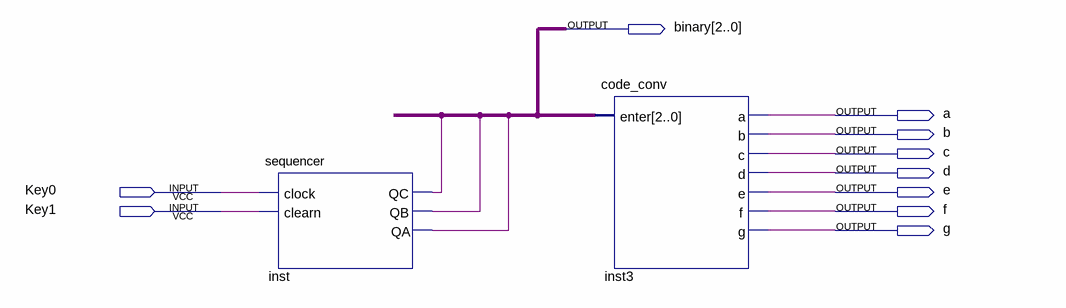
[diagram p0: schematic sheet]
// Quartus schematic procedure_3.bdf as structural Verilog: 2 symbols, 10 pins
module procedure_3 (
  input  Key0,
  input  Key1,
  output [2:0] binary,
  output a,
  output b,
  output c,
  output d,
  output e,
  output f,
  output g
);

  wire inst_qa, inst_qb, inst_qc;

  sequencer inst (.clock(Key0), .clearn(Key1), .QC(inst_qc), .QB(inst_qb), .QA(inst_qa));
  code_conv inst3 (.enter(binary), .a(a), .b(b), .c(c), .d(d), .e(e), .f(f), .g(g));
endmodule
